# Altium schematic sheet MCU.SchDoc
size A3
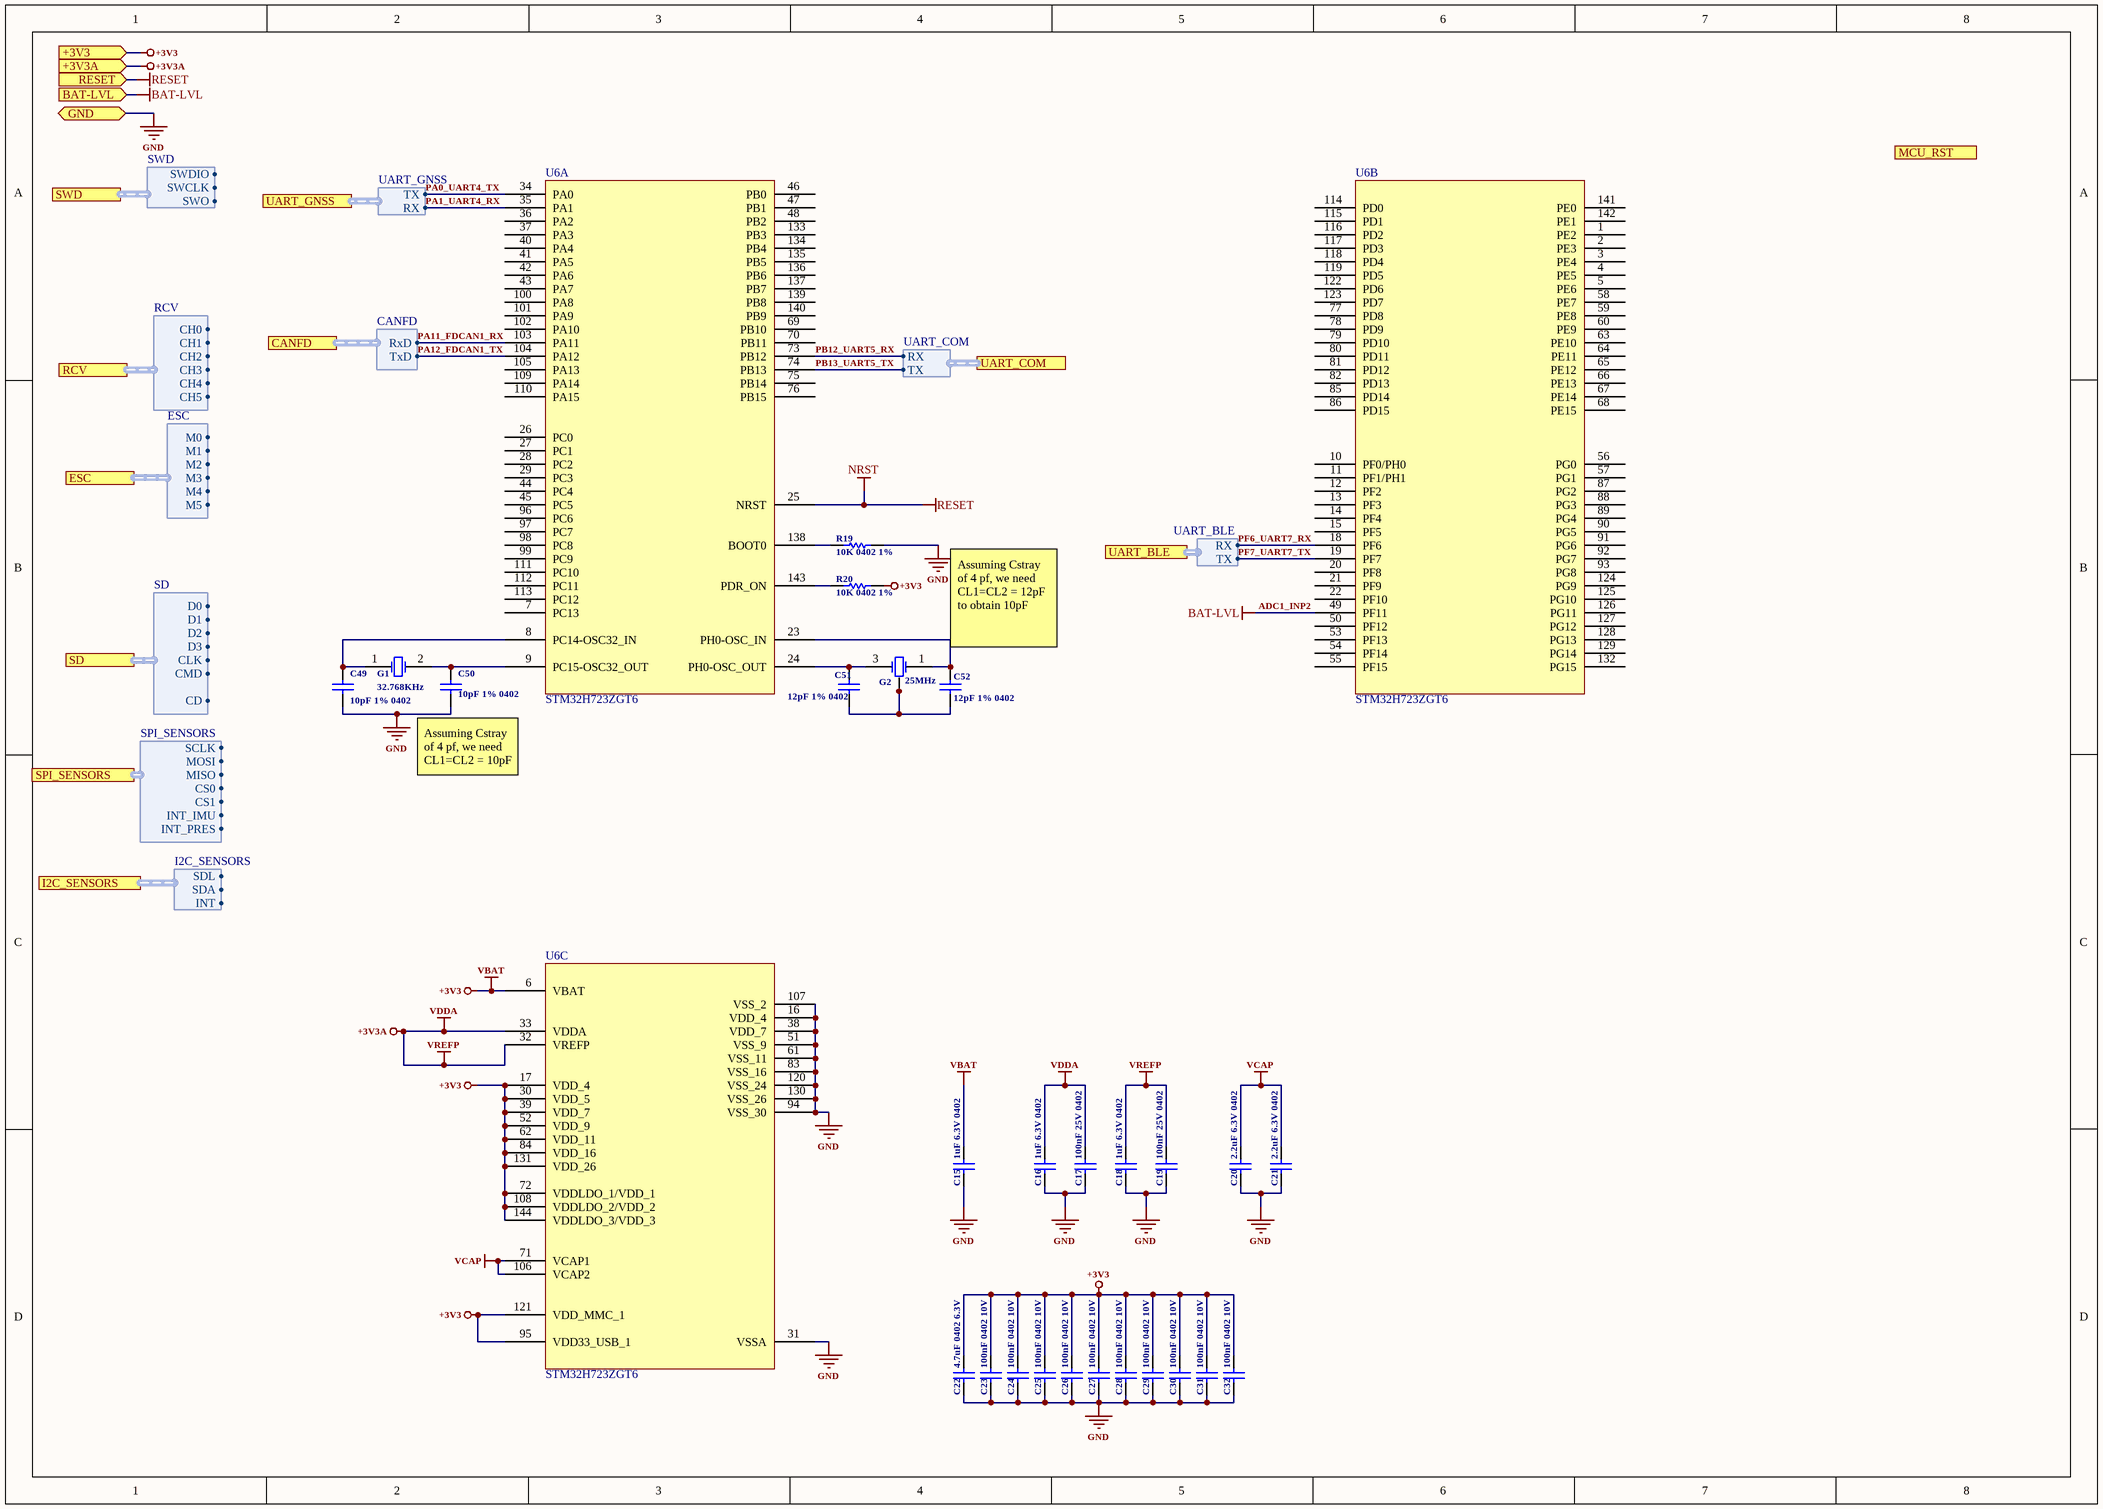
[diagram p0: MCU.SchDoc]

## Parts
C15  1uF 6.3V 0402
C16  1uF 6.3V 0402
C17  100nF 25V 0402
C18  1uF 6.3V 0402
C19  100nF 25V 0402
C20  2.2uF 6.3V 0402
C21  2.2uF 6.3V 0402
C22  4.7uF 0402 6.3V
C23  100nF 0402 10V
C24  100nF 0402 10V
C25  100nF 0402 10V
C26  100nF 0402 10V
C27  100nF 0402 10V
C28  100nF 0402 10V
C29  100nF 0402 10V
C30  100nF 0402 10V
C31  100nF 0402 10V
C32  100nF 0402 10V
C49  10pF 1% 0402
C50  10pF 1% 0402
C51  12pF 1% 0402
C52  12pF 1% 0402
G1  32.768KHz
G2  25MHz
R19  10K 0402 1%  [Resistor_0402]
R20  10K 0402 1%  [Resistor_0402]
U6  STM32H723ZGT6  (parts A,B,C of 3)

## Ports
+3V3 (in), +3V3A (in), BAT-LVL (in), CANFD (harness CANFD), ESC (harness ESC), GND (bidir), I2C_SENSORS (harness I2C_SENSORS), MCU_RST (out), RCV (harness RCV), RESET (in), SD (harness SD), SPI_SENSORS (harness SPI_SENSORS), SWD (harness SWD), UART_BLE (harness UART_BLE), UART_COM (harness UART_COM), UART_GNSS (harness UART_GNSS)

## Harnesses
SWD: SWDIO, SWCLK, SWO
UART_GNSS: TX, RX
UART_COM: TX, RX
RCV: CH0, CH1, CH2, CH3, CH4, CH5
ESC: M0, M1, M2, M3, M4, M5
CANFD: TxD, RxD
SD: CD, CMD, CLK, D0, D1, D2, D3
SPI_SENSORS: SCLK, MOSI, MISO, CS0, CS1, INT_IMU, INT_PRES
I2C_SENSORS: SDL, SDA, INT
UART_BLE: RX, TX

## Nets
+3V3: C15.2 C22.2 C23.2 C24.2 C25.2 C26.2 C27.2 C28.2 C29.2 C30.2 C31.2 C32.2 R20.2 U6.6(VBAT) U6.17(VDD_4) U6.30(VDD_5) U6.39(VDD_7) U6.52(VDD_9) U6.62(VDD_11) U6.72(VDDLDO_1/VDD_1) U6.84(VDD_16) U6.95(VDD33_USB_1) U6.108(VDDLDO_2/VDD_2) U6.121(VDD_MMC_1) U6.131(VDD_26) U6.144(VDDLDO_3/VDD_3) ; port +3V3  [also labelled VBAT]
+3V3A: C16.2 C17.2 C18.2 C19.2 U6.32(VREFP) U6.33(VDDA) ; port +3V3A  [also labelled VDDA, VREFP]
ADC1_INP2: U6.49(PF11) ; port BAT-LVL  [also labelled BAT-LVL]
GND: C15.1 C16.1 C17.1 C18.1 C19.1 C20.1 C21.1 C22.1 C23.1 C24.1 C25.1 C26.1 C27.1 C28.1 C29.1 C30.1 C31.1 C32.1 C49.1 C50.1 R19.2 U6.16(VDD_4) U6.31(VSSA) U6.38(VDD_7) U6.51(VSS_9) U6.61(VSS_11) U6.83(VSS_16) U6.94(VSS_30) U6.107(VSS_2) U6.120(VSS_24) U6.130(VSS_26) ; port GND
NRST: U6.25(NRST) ; port RESET  [also labelled RESET]
VCAP: C20.2 C21.2 U6.71(VCAP1) U6.106(VCAP2)
PA0_UART4_TX: U6.34(PA0) ; port UART_GNSS.TX
PA1_UART4_RX: U6.35(PA1) ; port UART_GNSS.RX
PA11_FDCAN1_RX: U6.103(PA11) ; port CANFD.RxD
PA12_FDCAN1_TX: U6.104(PA12) ; port CANFD.TxD
PB12_UART5_RX: U6.73(PB12) ; port UART_COM.RX
PB13_UART5_TX: U6.74(PB13) ; port UART_COM.TX
PF6_UART7_RX: U6.18(PF6) ; port UART_BLE.RX
PF7_UART7_TX: U6.19(PF7) ; port UART_BLE.TX
NetC49_2: C49.2 G1.1(OSC1) U6.8(PC14-OSC32_IN)
NetC50_2: C50.2 G1.2(OSC2) U6.9(PC15-OSC32_OUT)
NetC51_1: C51.1 C52.1 G2.2(GND) G2.4(GND)
NetC51_2: C51.2 G2.3(OSC1) U6.24(PH0-OSC_OUT)
NetC52_2: C52.2 G2.1(OSC2) U6.23(PH0-OSC_IN)
NetR19_1: R19.1 U6.138(BOOT0)
NetR20_1: R20.1 U6.143(PDR_ON)

Not connected (* = marked no-connect by the designer): U6 1(PE2) 2(PE3) 3(PE4) 4(PE5) 5(PE6) 7(PC13) 10(PF0/PH0) 11(PF1/PH1) 12(PF2) 13(PF3) 14(PF4) 15(PF5) 20(PF8) 21(PF9) 22(PF10) 26(PC0) 27(PC1) 28(PC2) 29(PC3) 36(PA2) 37(PA3) 40(PA4) 41(PA5) 42(PA6) 43(PA7) 44(PC4) 45(PC5) 46(PB0) 47(PB1) 48(PB2) 50(PF12) 53(PF13) 54(PF14) 55(PF15) 56(PG0) 57(PG1) 58(PE7) 59(PE8) 60(PE9) 63(PE10) 64(PE11) 65(PE12) 66(PE13) 67(PE14) 68(PE15) 69(PB10) 70(PB11) 75(PB14) 76(PB15) 77(PD8) 78(PD9) 79(PD10) 80(PD11) 81(PD12) 82(PD13) 85(PD14) 86(PD15) 87(PG2) 88(PG3) 89(PG4) 90(PG5) 91(PG6) 92(PG7) 93(PG8) 96(PC6) 97(PC7) 98(PC8) 99(PC9) 100(PA8) 101(PA9) 102(PA10) 105(PA13) 109(PA14) 110(PA15) 111(PC10) 112(PC11) 113(PC12) 114(PD0) 115(PD1) 116(PD2) 117(PD3) 118(PD4) 119(PD5) 122(PD6) 123(PD7) 124(PG9) 125(PG10) 126(PG11) 127(PG12) 128(PG13) 129(PG14) 132(PG15) 133(PB3) 134(PB4) 135(PB5) 136(PB6) 137(PB7) 139(PB8) 140(PB9) 141(PE0) 142(PE1)

## Notes on the sheet
- Assuming Cstray of 4 pf, we need CL1=CL2 = 12pF to obtain 10pF
- (near C50) Assuming Cstray of 4 pf, we need CL1=CL2 = 10pF

## Library data of the parts
C15 C16 C18 = CL05A105KQ5NNNC 1uF 0402: SAMSUNG ELECTRO-MECHANICS - CL05A105KQ5NNNC - SMD Multilayer Ceramic Capacitor, 1 µF, 6.3 V, 0402 [1005 Metric], ± 10%, X5R, CL Series; Capacitance: 1000000 pF; Supplier 1: Digi-Key; Manufacturer: Samsung; Manufacturer Part Number: CL05A105KQ5NNNC; Stock 1: 2633061; Pricing 1: 1=0.1, 10=0.019, 50=0.0106, 100=0.0087, 500=0.0062, 1000=0.0049, 2500=0.0044, 5000=0.0041 (USD); Case Size/Dimension: 0402; Dielectric: X5R; Tolerance (%): ±10 %; Rated Voltage: 6.3 V; ComponentLink1URL: http://www.samsungsem.com/kr/support/product-search/mlcc/CL05A105KQ5NNNC.jsp?src-supplier=Digi-Key; ComponentLink1Description: http://www.samsungsem.com/kr/support/product-search/mlcc/CL05A105KQ5NNNC.jsp?src-supplier=Digi-Key; ComponentLink2URL: http://www1.futureelectronics.com/doc/SAMSUNG%20PASSIVE/CL05B104KQ5NNNC.pdf?src-supplier=Future+Electronics; ComponentLink2Description: http://www1.futureelectronics.com/doc/SAMSUNG%20PASSIVE/CL05B104KQ5NNNC.pdf?src-supplier=Future+Electronics; ComponentLink3URL: https://www.verical.com/server-webapp/html/getDatasheet?partID=358391&src-supplier=Verical; ComponentLink3Description: https://www.verical.com/server-webapp/html/getDatasheet?partID=358391&src-supplier=Verical; ComponentLink4URL: https://produktinfo.conrad.com/datenblaetter/450000-474999/459172-da-01-en-VS_KONDENSATOR_0402.pdf?src-supplier=Conrad; ComponentLink4Description: https://produktinfo.conrad.com/datenblaetter/450000-474999/459172-da-01-en-VS_KONDENSATOR_0402.pdf?src-supplier=Conrad; Supplier Part Number 1: 1276-1010-1-ND; Value: 1uF 6.3V 0402
C17 C19 = CL05A104KA5NNNC 100nf 0402: 100nF, 25V, MLCC, 0402; Manufacturer: Samsung; Capacitance: 0.1 µF; Dielectric: X5R; Tolerance (%): ±10 %; Supplier 1: Digi-Key; Manufacturer Part Number: CL05A104KA5NNNC; Stock 1: 8000233; Pricing 1: 1=0.1, 10=0.012, 50=0.0064, 100=0.0053, 500=0.0038, 1000=0.003, 2500=0.0027, 5000=0.0025 (USD); Case Size/Dimension: 0402; Rated Voltage: 25 V; ComponentLink1URL: http://www1.futureelectronics.com/doc/SAMSUNG/CL05A104KA5NNNC.pdf?src-supplier=Future+Electronics; ComponentLink1Description: http://www1.futureelectronics.com/doc/SAMSUNG/CL05A104KA5NNNC.pdf?src-supplier=Future+Electronics; ComponentLink2URL: http://www.samsungsem.com/kr/support/product-search/mlcc/CL05A104KA5NNNC.jsp?src-supplier=Digi-Key; ComponentLink2Description: http://www.samsungsem.com/kr/support/product-search/mlcc/CL05A104KA5NNNC.jsp?src-supplier=Digi-Key; ComponentLink3URL: https://www.distrelec.biz/Web/Downloads/_e/ng/MLCC_CatalogDownload2013_ENG.pdf?mime=application%2Fpdf&src-supplier=Distrelec; ComponentLink3Description: https://www.distrelec.biz/Web/Downloads/_e/ng/MLCC_CatalogDownload2013_ENG.pdf?mime=application%2Fpdf&src-supplier=Distrelec; ComponentLink4URL: https://www.verical.com/server-webapp/html/getDatasheet?partID=357412&src-supplier=Verical; ComponentLink4Description: https://www.verical.com/server-webapp/html/getDatasheet?partID=357412&src-supplier=Verical; Supplier Part Number 1: 1276-1043-1-ND; Value: 100nF 25V 0402
C20 C21 = CL05A225MQ5NNNC 2.2uF 0402: CAP CER 2.2UF 6.3V X5R 0402; Designator: C?; Supplier 1: Digi-Key; Supplier Part Number 1: 1276-1469-1-ND; Value: 2.2uF 6.3V 0402
C22 = GRM155R60J475ME87D 4.7uF 0402 6.3V: MURATA - GRM155R60J475ME87D - SMD Multilayer Ceramic Capacitor, 4.7 µF, 6.3 V, 0402 [1005 Metric], ± 20%, X5R, GRM Series; Rad Hard: No; Product Depth: 0.5 mm; Voltage: 6.3 Vdc; Product Length: 1 mm; Supplier 1: Digi-Key; Manufacturer: Murata; Manufacturer Part Number: GRM155R60J475ME87D; Stock 1: 78795; Pricing 1: 1=0.14, 10=0.101, 50=0.0572, 100=0.0474, 500=0.0332, 1000=0.0275, 2500=0.0256, 5000=0.0234 (USD); Packaging: Tape & Reel; Package/Case: 0402; Mounting: Surface Mount; Capacitance Value: 4.7 uF; Tolerance: 20 %; Dielectric: X5R; Operating Temperature: -55 to 85 °C; Construction: Flat; Product Height: 0.5 mm; Category: Capacitor Ceramic Multilayer; ComponentLink1URL: https://www.murata.com/~/media/webrenewal/support/library/catalog/products/capacitor/mlcc/c02e.ashx?la=en-us&src-supplier=Digi-Key; ComponentLink1Description: https://www.murata.com/~/media/webrenewal/support/library/catalog/products/capacitor/mlcc/c02e.ashx?la=en-us&src-supplier=Digi-Key; ComponentLink2URL: http://components.arrow.com/part/dataview/47740841S8828489N2606?src-supplier=Arrow+Electronics; ComponentLink2Description: http://components.arrow.com/part/dataview/47740841S8828489N2606?src-supplier=Arrow+Electronics; Supplier Part Number 1: 490-5408-1-ND; Value: 4.7uF 0402 6.3V
C23-C32 = CL05A104KP5NNNC 100nF 0402 10V: Cap Ceramic 0.1uF 10V X5R 10% SMD 0402 85C Paper T/R; Manufacturer: Samsung; Capacitance: 100000 pF; Supplier 1: Digi-Key; Manufacturer Part Number: CL05A104KP5NNNC; Stock 1: 5595689; Pricing 1: 1=0.1, 10=0.021, 50=0.0116, 100=0.0094, 500=0.0067, 1000=0.0053, 2500=0.0048, 5000=0.0044 (USD); Case Size/Dimension: 0402; Dielectric: X5R; Tolerance (%): ±10 %; Rated Voltage: 10 V; ComponentLink1URL: https://www.distrelec.biz/Web/Downloads/_e/ng/MLCC_CatalogDownload2013_ENG.pdf?mime=application%2Fpdf&src-supplier=Distrelec; ComponentLink1Description: https://www.distrelec.biz/Web/Downloads/_e/ng/MLCC_CatalogDownload2013_ENG.pdf?mime=application%2Fpdf&src-supplier=Distrelec; ComponentLink2URL: https://media.digikey.com/pdf/Data%20Sheets/Samsung%20PDFs/CL_Series_MLCC_ds.pdf?src-supplier=Digi-Key; ComponentLink2Description: https://media.digikey.com/pdf/Data%20Sheets/Samsung%20PDFs/CL_Series_MLCC_ds.pdf?src-supplier=Digi-Key; ComponentLink3URL: http://www1.futureelectronics.com/doc/SAMSUNG%20PASSIVE/CL05B104KQ5NNNC.pdf?src-supplier=Future+Electronics; ComponentLink3Description: http://www1.futureelectronics.com/doc/SAMSUNG%20PASSIVE/CL05B104KQ5NNNC.pdf?src-supplier=Future+Electronics; ComponentLink4URL: https://www.verical.com/server-webapp/html/getDatasheet?partID=358611&src-supplier=Verical; ComponentLink4Description: https://www.verical.com/server-webapp/html/getDatasheet?partID=358611&src-supplier=Verical; Supplier Part Number 1: 1276-1022-1-ND; Value: 100nF 0402 10V
C49 C50 = CC0402FRNPO9BN100: 10 pF ±1% 50V Ceramic Capacitor C0G, NP0 0402 (1005 Metric); Supplier 1: Digi-Key; Supplier Part Number 1: 311-1640-1-ND; Value: 10pF 1% 0402
C51 C52 = CC0402FRNPO9BN120: 12 pF ±1% 50V Ceramic Capacitor C0G, NP0 0402 (1005 Metric); Supplier 1: Digi-Key; Supplier Part Number 1: 311-1641-1-ND; Value: 12pF 1% 0402
G1 = ECS-.327-9-34B-C-TR: 32.768 kHz ±10ppm Crystal 9pF 70 kOhms 2-SMD, No Lead; Value: 32.768KHz; Supplier 1: Digi-Key; Supplier Part Number 1: XC1949CT-ND
G2 = ECS-250-10-36B2-CTN-TR: 25 MHz ±10ppm Crystal 10pF 50 Ohms 4-SMD, No Lead; Supplier 1: Digi-Key; Supplier Part Number 1: 50-ECS-250-10-36B2-CTN-TRCT-ND; Value: 25MHz
R19 R20 = AC0402FR-0710KL 10K 0402 1%: RES SMD 10K OHM 1% 1/16W 0402; Manufacturer: Yageo; Resistance: 10 kOhms; Power Rating: 62.5 mW (1/16 W); Voltage Rating: 50 V; Temperature Coefficient: 100 PPM / C; Supplier 1: Digi-Key; Manufacturer Part Number: AC0402FR-0710KL; Stock 1: 1375478; Pricing 1: 1=0.1, 10=0.021, 100=0.0086, 1000=0.0039, 2500=0.0033, 5000=0.0028 (USD); Termination Style: SMD/SMT; Product: Thick Film Resistors SMD; Tolerance: 1 %; Case Code - in: 0402; Case Code - mm: 1005; Series: AC; Operating Temperature Range: - 55 C to + 155 C; Packaging: Reel; ComponentLink1URL: http://www.mouser.com/ds/2/447/yageodocoutput-1111992.pdf?src-supplier=Mouser; ComponentLink1Description: http://www.mouser.com/ds/2/447/yageodocoutput-1111992.pdf?src-supplier=Mouser; Supplier Part Number 1: YAG3436CT-ND; Value: 10K 0402 1%
U6 = STM32H723ZGT6: Supplier 1: Digi-Key; Supplier Part Number 1: 497-STM32H723ZGT6-ND